# Altium schematic sheet 0083_USB3.SchDoc
size 848 x 558 mm
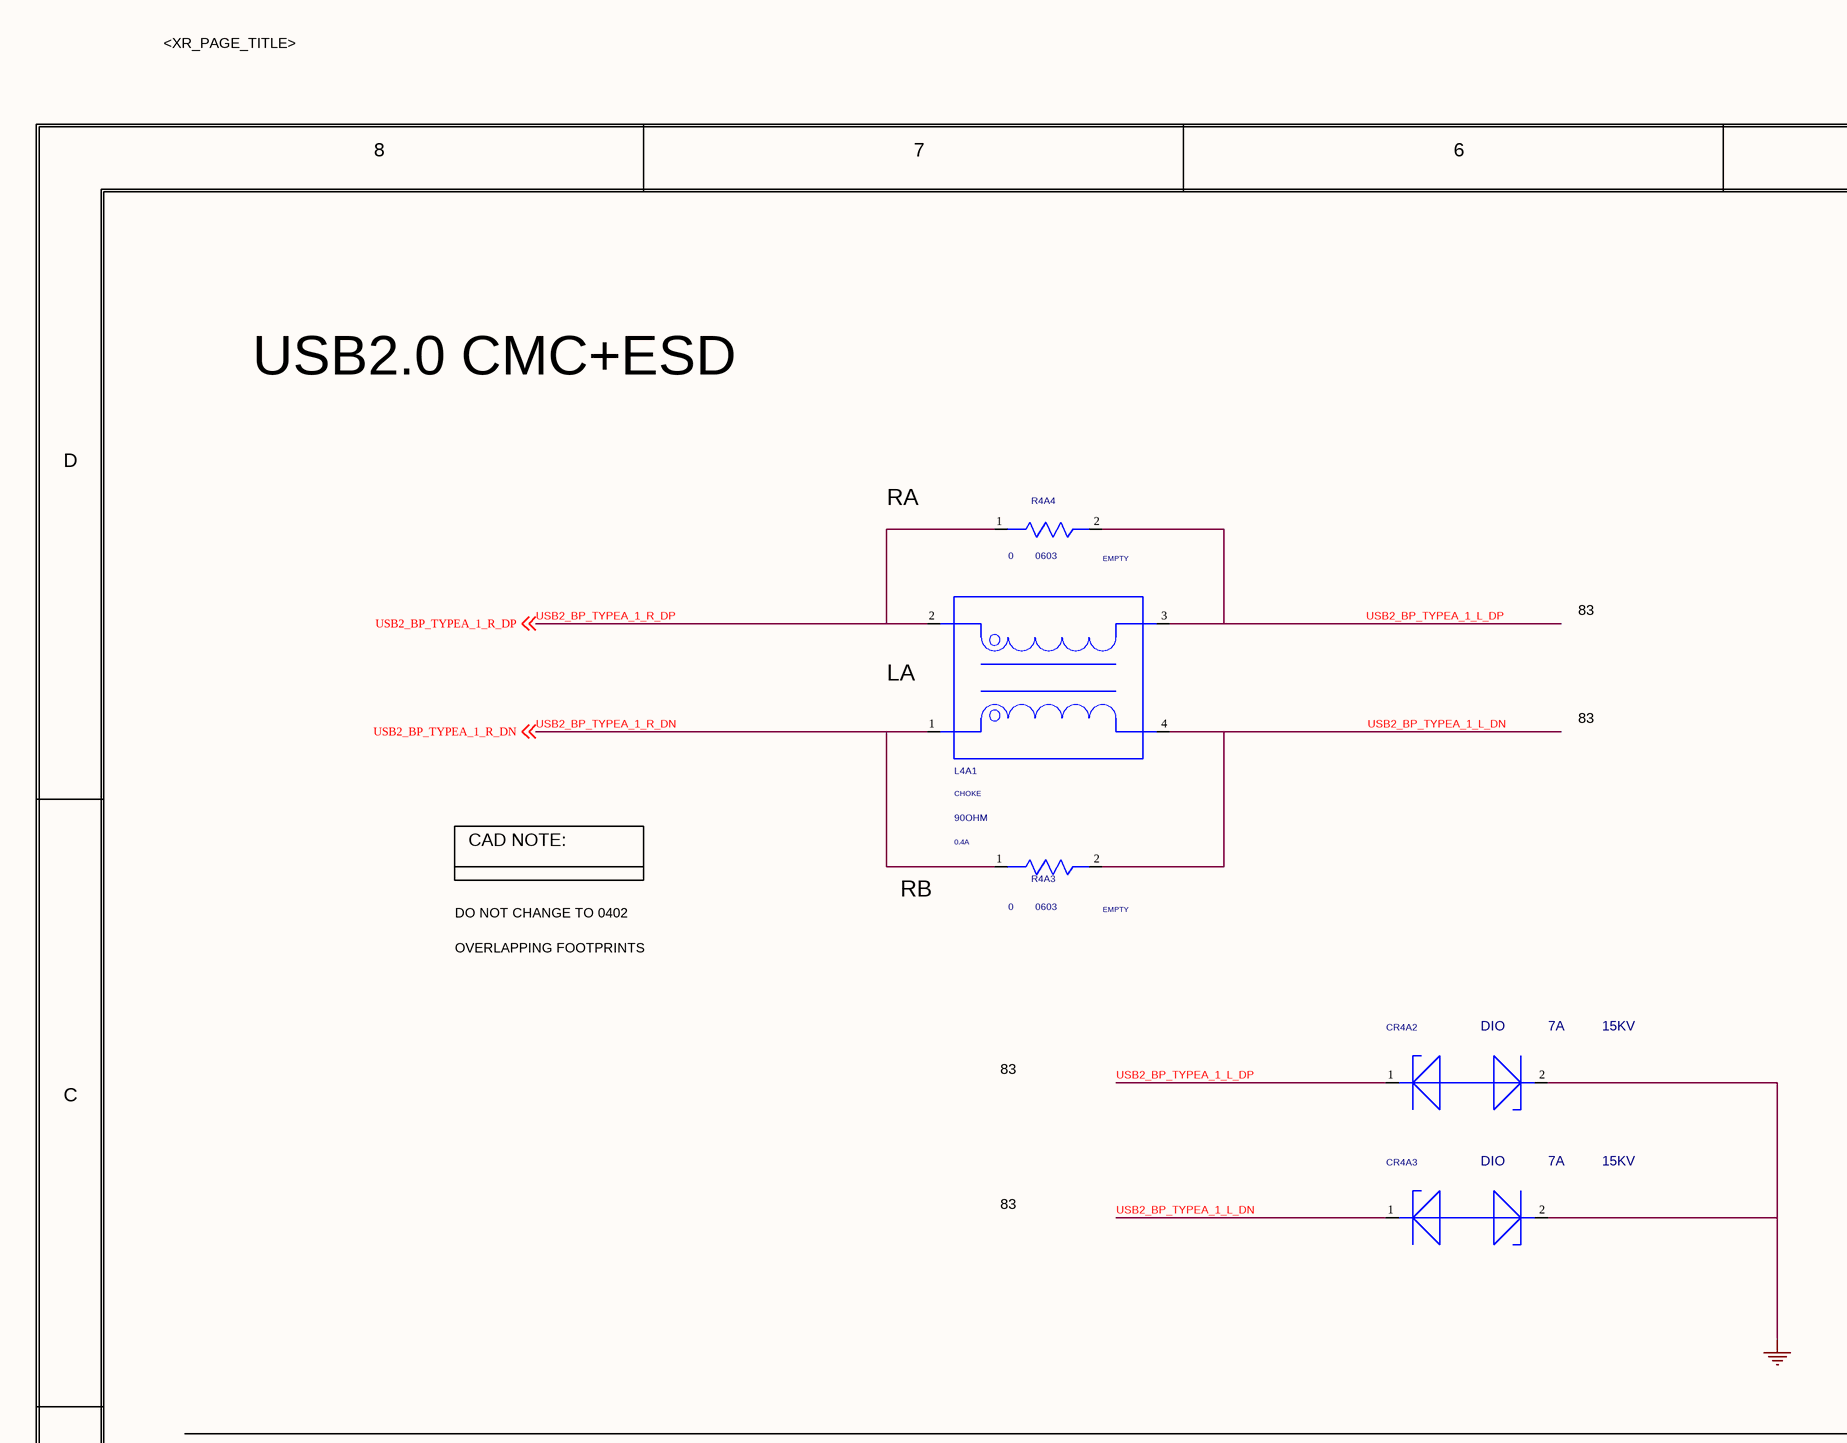
[diagram p0: 0083_USB3.SchDoc, top left]
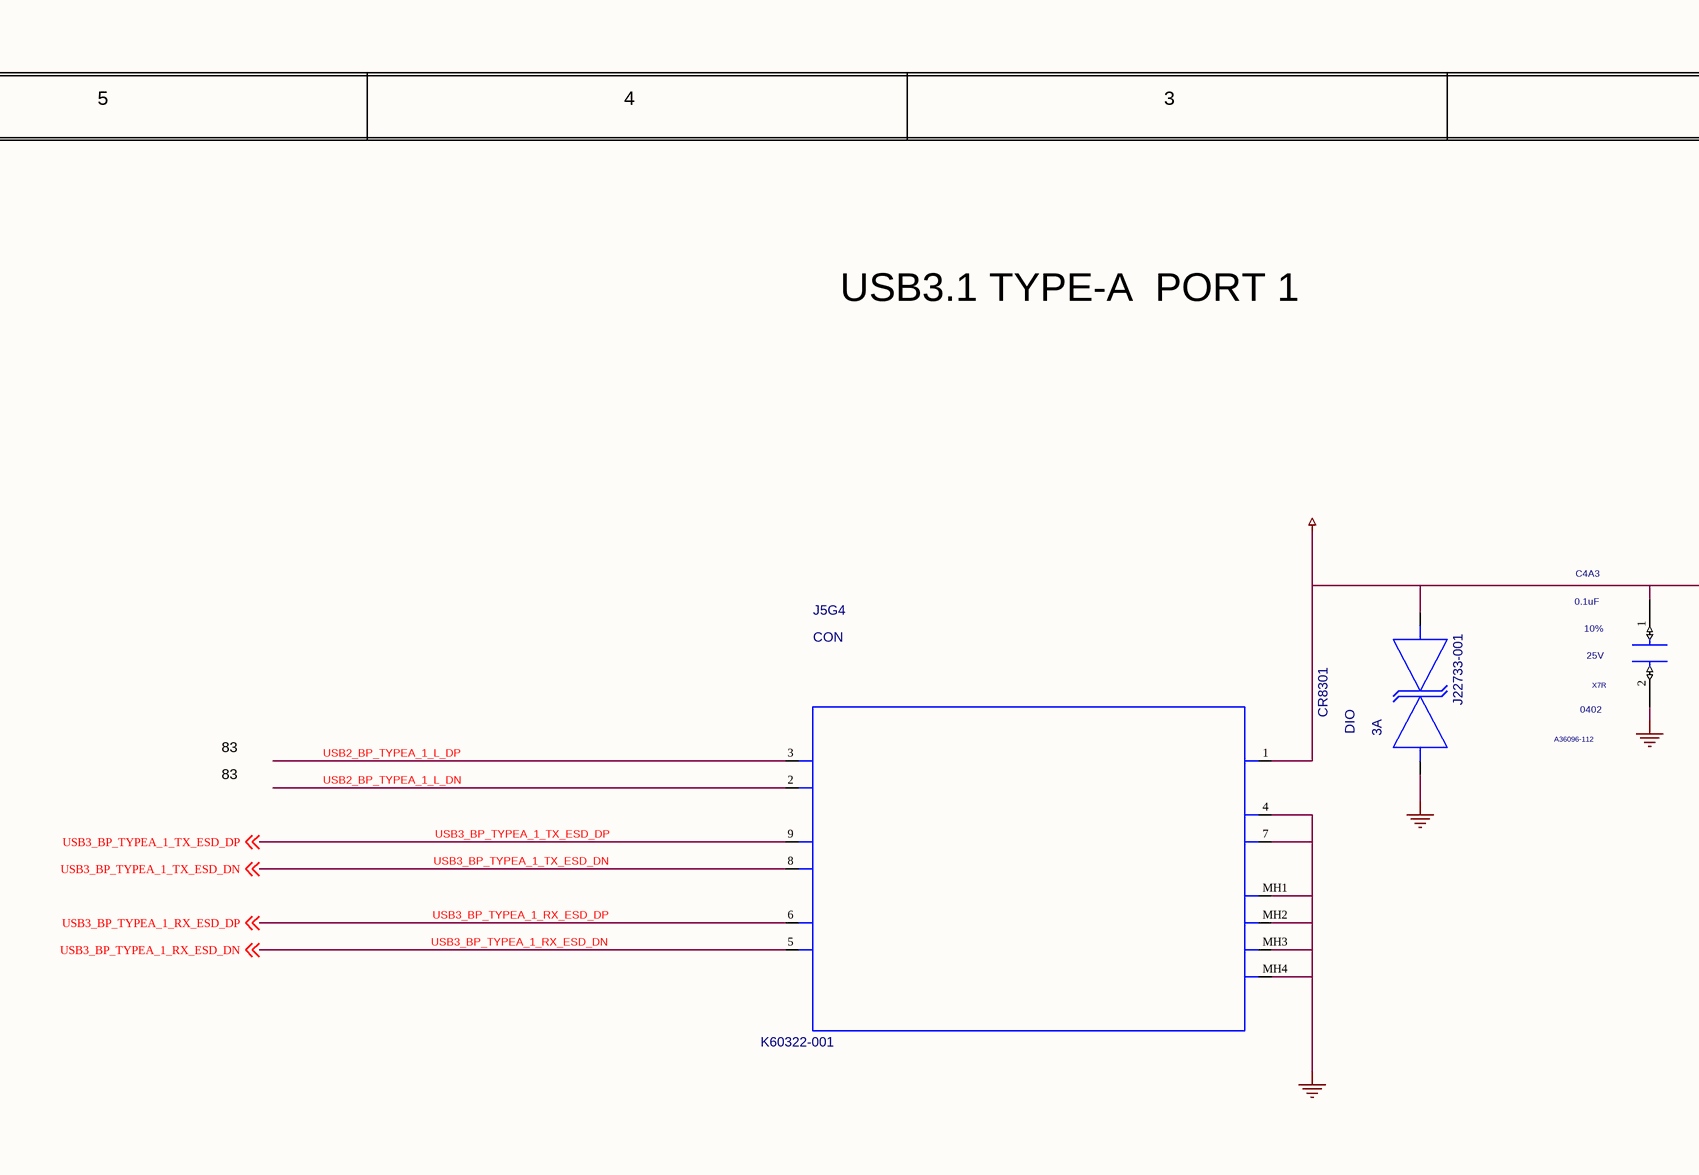
[diagram p1: 0083_USB3.SchDoc, top middle]
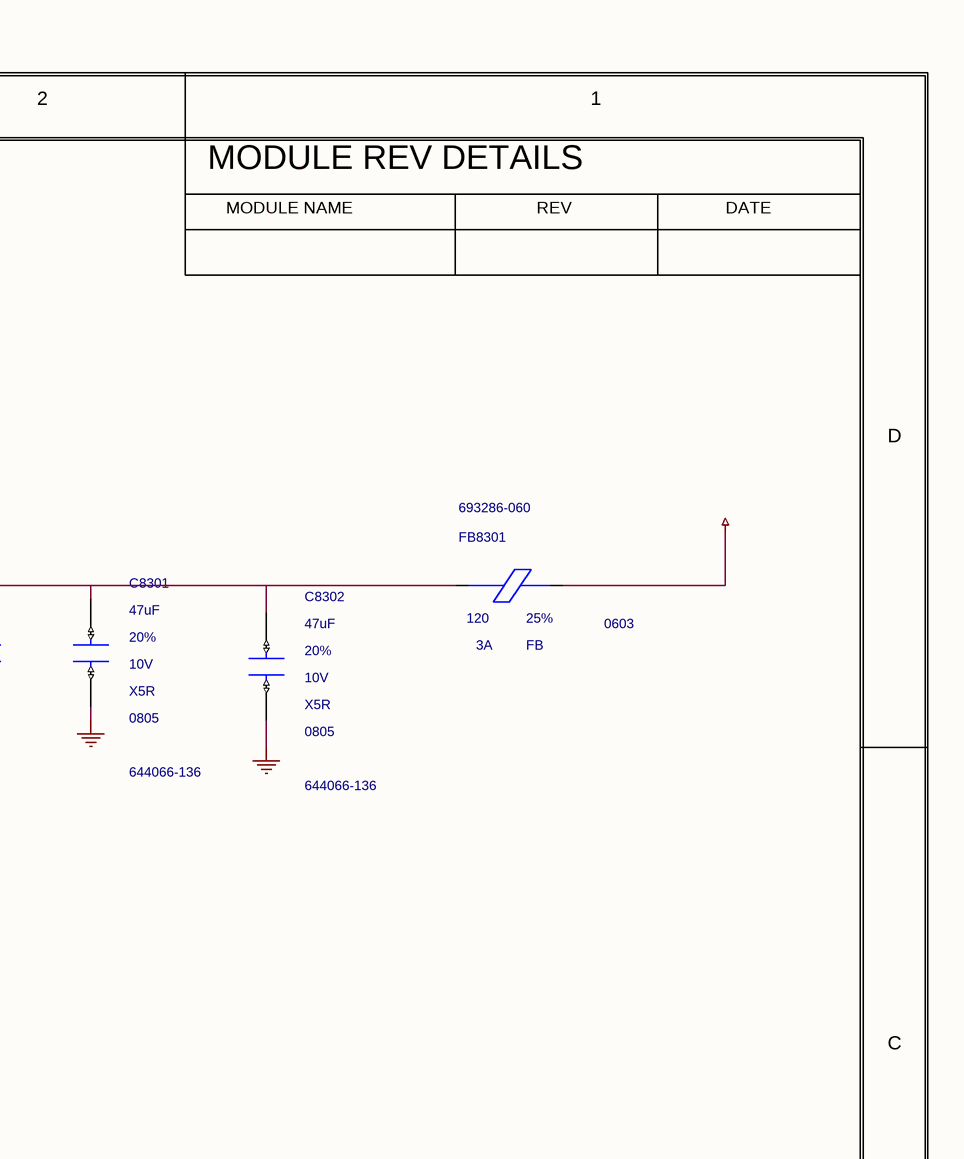
[diagram p2: 0083_USB3.SchDoc, top right]
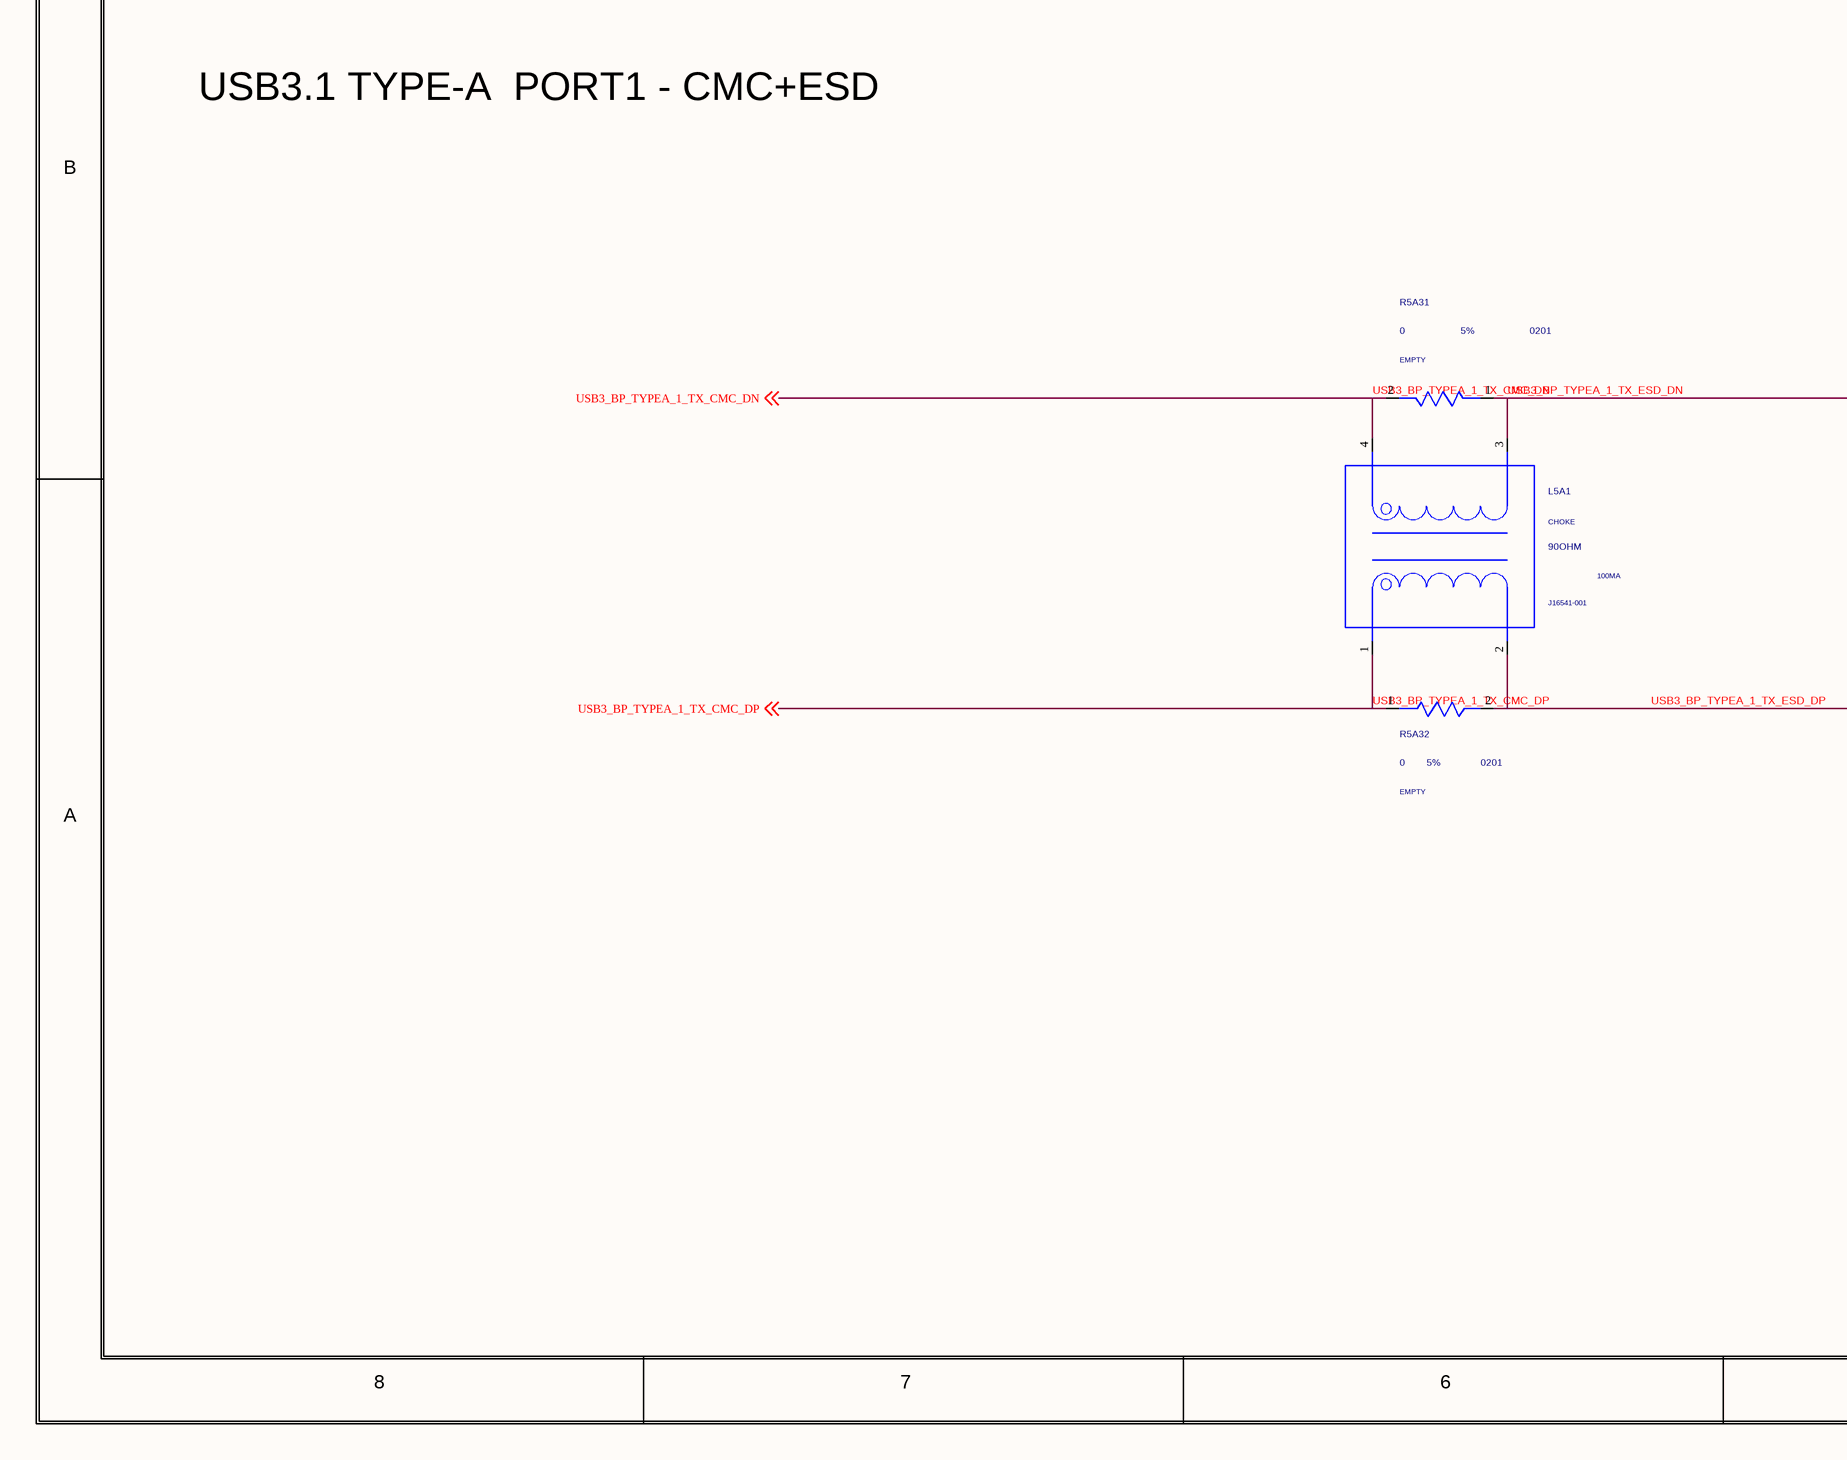
[diagram p3: 0083_USB3.SchDoc, bottom left]
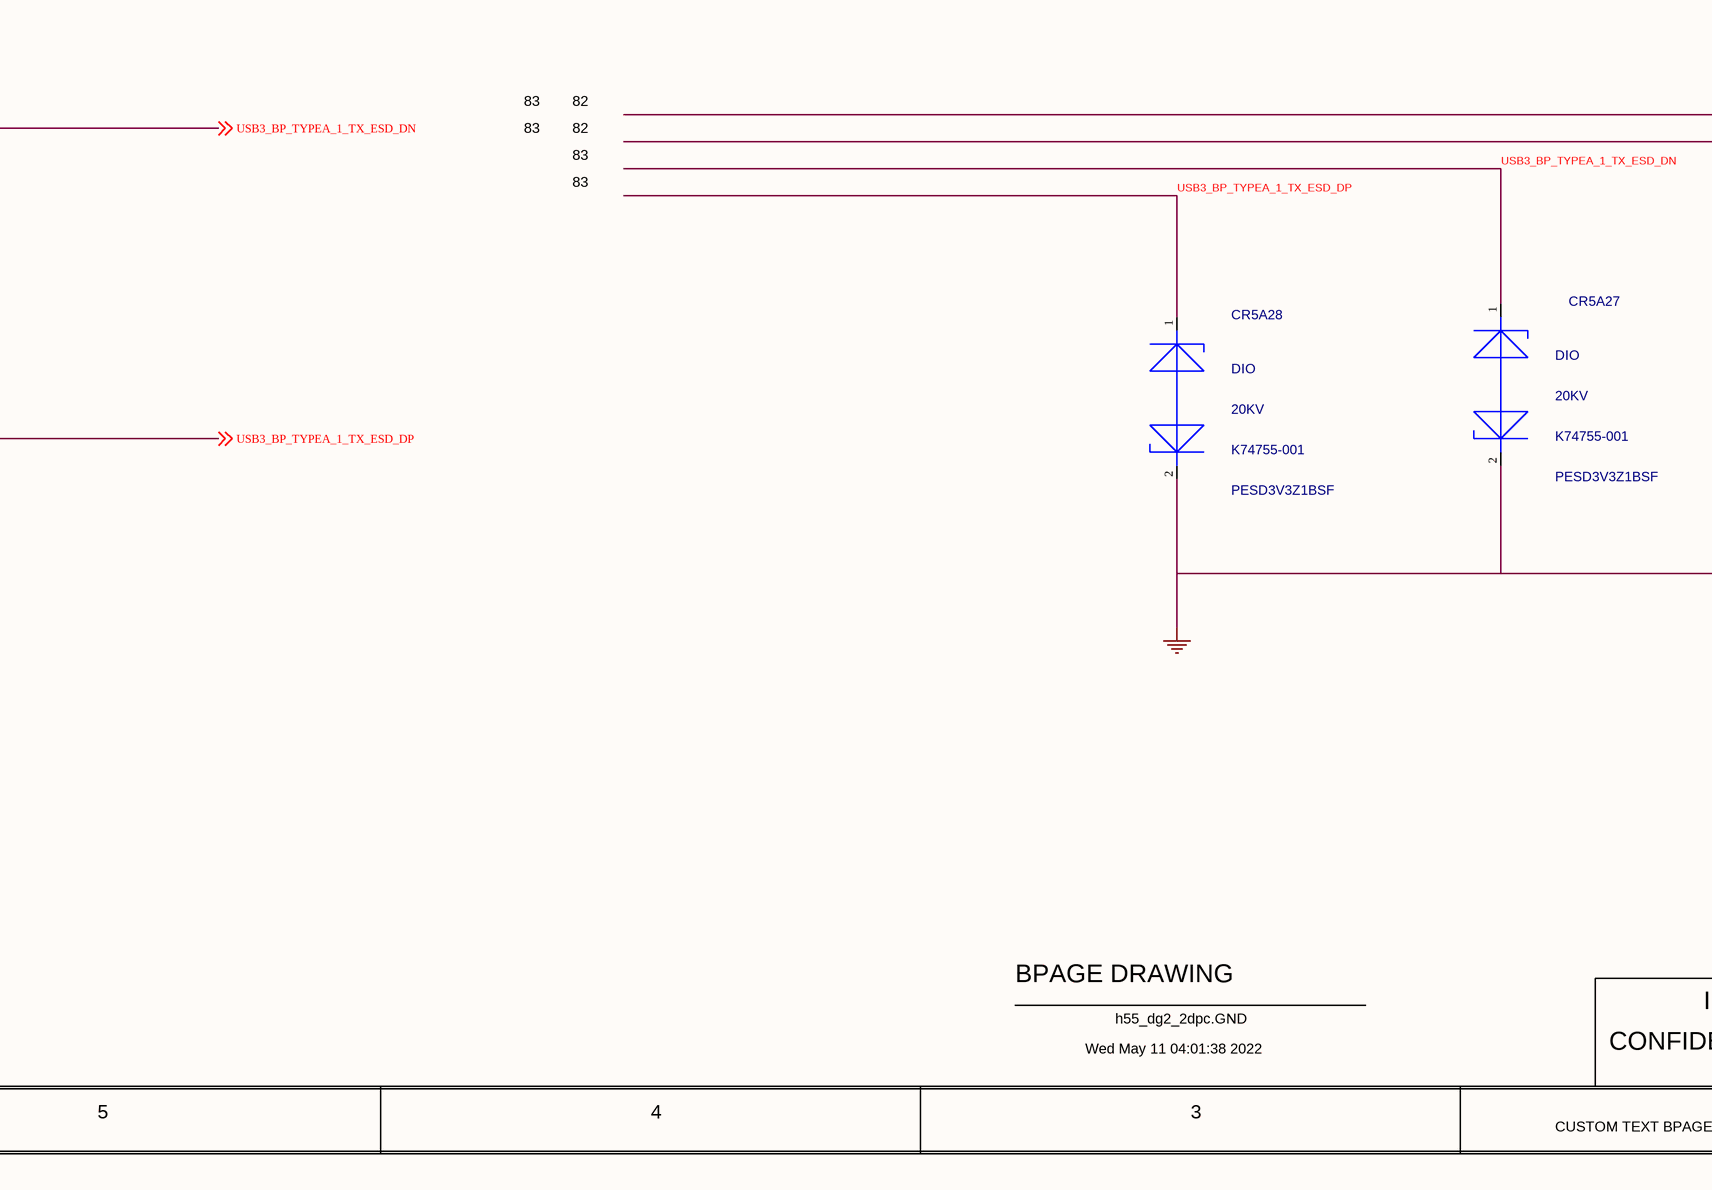
[diagram p4: 0083_USB3.SchDoc, bottom middle]
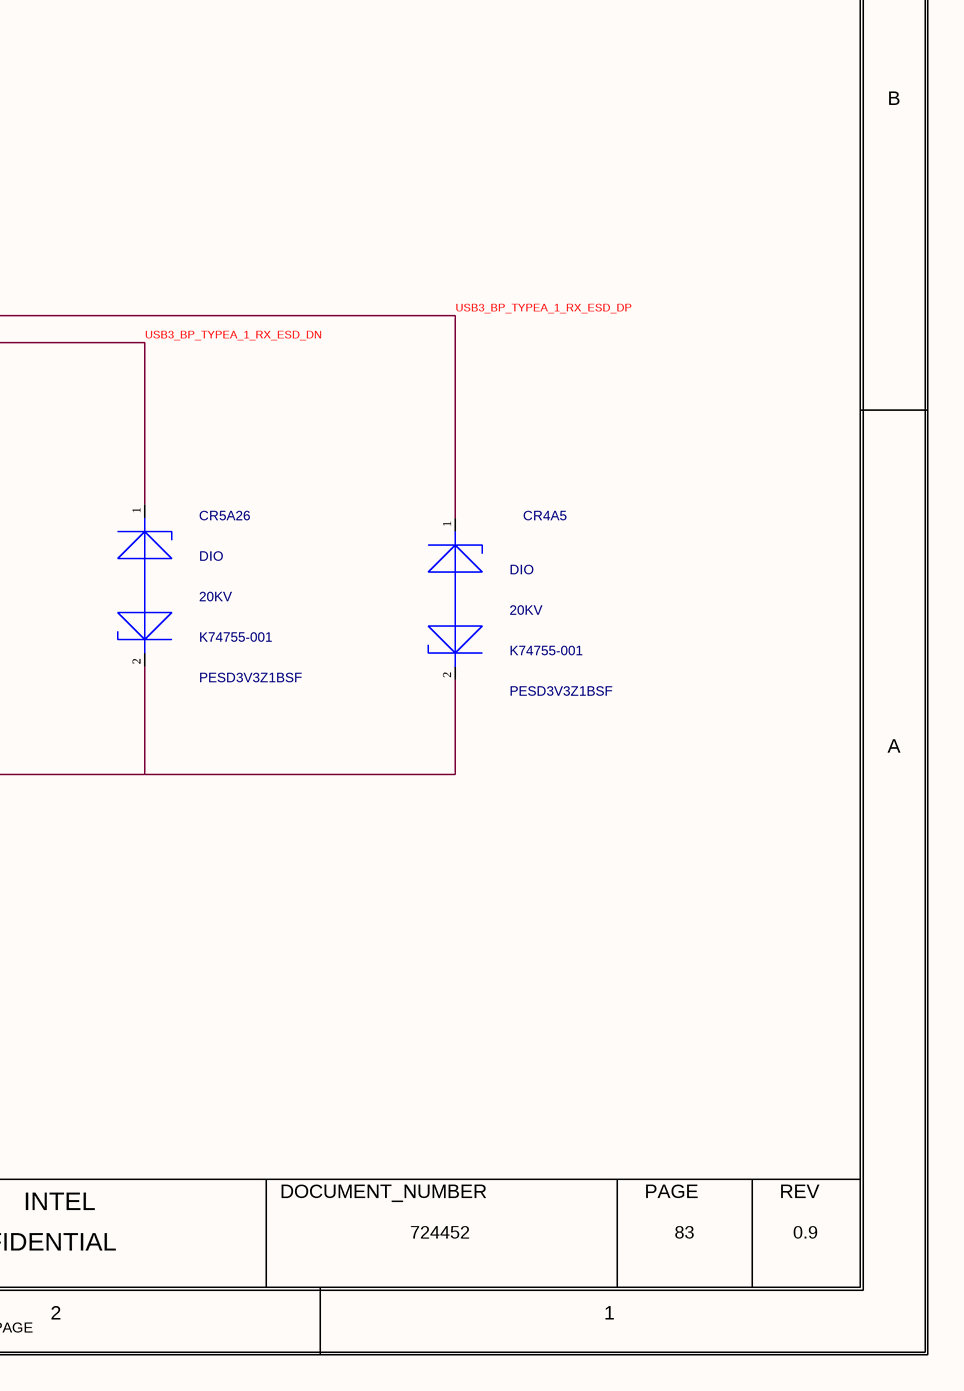
[diagram p5: 0083_USB3.SchDoc, bottom right]

## Parts
C4A3  0.1uF  MATERIAL: X7R  PACK_TYPE: 0402  PART_NUMBER: A36096-112  TOLERANCE: 10%  VOLTAGE: 25V  [SMC0402IA]
C8301  47uF  MATERIAL: X5R  PACK_TYPE: 0805  PART_NUMBER: 644066-136  TOLERANCE: 20%  VOLTAGE: 10V  [CTK2_SM0805_2200X1450_MA]
C8302  47uF  MATERIAL: X5R  PACK_TYPE: 0805  PART_NUMBER: 644066-136  TOLERANCE: 20%  VOLTAGE: 10V  [CTK2_SM0805_2200X1450_MA]
CR4A2  15KV  CURRENT: 7A  MATERIAL: DIO  [TK0_SOD962_600X300_MA]
CR4A3  15KV  CURRENT: 7A  MATERIAL: DIO  [TK0_SOD962_600X300_MA]
CR4A5  PESD3V3Z1BSF  CURRENT: 20KV  MATERIAL: DIO  PART_NUMBER: K74755-001  [TK0_SCR_625X325_MB]
CR5A26  PESD3V3Z1BSF  CURRENT: 20KV  MATERIAL: DIO  PART_NUMBER: K74755-001  [TK0_SCR_625X325_MB]
CR5A27  PESD3V3Z1BSF  CURRENT: 20KV  MATERIAL: DIO  PART_NUMBER: K74755-001  [TK0_SCR_625X325_MB]
CR5A28  PESD3V3Z1BSF  CURRENT: 20KV  MATERIAL: DIO  PART_NUMBER: K74755-001  [TK0_SCR_625X325_MB]
CR8301  CURRENT: 3A  MATERIAL: DIO  PART_NUMBER: J22733-001  [CTK2_SCR0201_610X310_MA]  (hidden comment: ESD200-B1-CSP0201)
FB8301  120  CURRENT: 3A  MATERIAL: FB  PACK_TYPE: 0603  PART_NUMBER: 693286-060  TOLERANCE: 25%  [CTK2_SM0603_1750X950_MA]
J5G4  MATERIAL: CON  PART_NUMBER: K60322-001  [CUSB3_MIDJR_9P_4EM_2000_MA_PIP_MR]  (hidden comment: C_USB3_TYPE_A_9P_4EM)
L4A1  90OHM  CURRENT: 0.4A  MATERIAL: CHOKE  [SMI4_79X47IA]
L5A1  90OHM  CURRENT: 100MA  MATERIAL: CHOKE  PART_NUMBER: J16541-001  [SMI4_50X65MA]
R4A3  0  MATERIAL: EMPTY  PACK_TYPE: 0603  [SMR0603IA]
R4A4  0  MATERIAL: EMPTY  PACK_TYPE: 0603  [SMR0603IA]
R5A31  0  MATERIAL: EMPTY  PACK_TYPE: 0201  TOLERANCE: 5%  [SMR0201IA]
R5A32  0  MATERIAL: EMPTY  PACK_TYPE: 0201  TOLERANCE: 5%  [SMR0201IA]

## Nets
+V5A_USB_P1: FB8301.2(B)
+V5A_USB_P1_FB: C4A3.1(A) C8301.1(A) C8302.1(A) CR8301.2(A2) FB8301.1(A) J5G4.1(VBUS_POWER)
GND: C4A3.2(B) C8301.2(B) C8302.2(B) CR4A2.2(K2) CR4A3.2(K2) CR4A5.2(K2) CR5A26.2(K2) CR5A27.2(K2) CR5A28.2(K2) CR8301.1(A1) J5G4.4(GND_POWER_RETURN) J5G4.7(GND) J5G4.MH1 J5G4.MH2 J5G4.MH3 J5G4.MH4
USB2_BP_TYPEA_1_L_DN: CR4A3.1(K1) J5G4.2(D_DN) L4A1.4(OUT_1) R4A3.2(B)
USB2_BP_TYPEA_1_L_DP: CR4A2.1(K1) J5G4.3(D_DP) L4A1.3(IN_2) R4A4.2(B)
USB2_BP_TYPEA_1_R_DN: L4A1.1(IN_1) R4A3.1(A) ; off-sheet USB2_BP_TYPEA_1_R_DN
USB2_BP_TYPEA_1_R_DP: L4A1.2(OUT_2) R4A4.1(A) ; off-sheet USB2_BP_TYPEA_1_R_DP
USB3_BP_TYPEA_1_RX_ESD_DN: CR5A26.1(K1) J5G4.5(SSRX_DN) ; off-sheet USB3_BP_TYPEA_1_RX_ESD_DN
USB3_BP_TYPEA_1_RX_ESD_DP: CR4A5.1(K1) J5G4.6(SSRX_DP) ; off-sheet USB3_BP_TYPEA_1_RX_ESD_DP
USB3_BP_TYPEA_1_TX_CMC_DN: L5A1.4(PIN4) R5A31.2(B) ; off-sheet USB3_BP_TYPEA_1_TX_CMC_DN
USB3_BP_TYPEA_1_TX_CMC_DP: L5A1.1(PIN1) R5A32.1(A) ; off-sheet USB3_BP_TYPEA_1_TX_CMC_DP
USB3_BP_TYPEA_1_TX_ESD_DN: CR5A27.1(K1) J5G4.8(SSTX_DN) L5A1.3(PIN3) R5A31.1(A) ; off-sheet USB3_BP_TYPEA_1_TX_ESD_DN
USB3_BP_TYPEA_1_TX_ESD_DP: CR5A28.1(K1) J5G4.9(SSTX_DP) L5A1.2(PIN2) R5A32.2(B) ; off-sheet USB3_BP_TYPEA_1_TX_ESD_DP

## Notes on the sheet
- <XR_PAGE_TITLE>
- 8
- 7
- 6
- 5
- 4
- 3
- 2
- 1
- MODULE REV DETAILS
- MODULE NAME
- REV
- DATE
- USB2.0 CMC+ESD
- USB3.1 TYPE-A  PORT 1
- D
- RA
- 83
- (near L4A1) LA
- CAD NOTE:
- DO NOT CHANGE TO 0402
- RB
- OVERLAPPING FOOTPRINTS
- C
- USB3.1 TYPE-A  PORT1 - CMC+ESD
- B
- 82
- A
- BPAGE DRAWING
- INTEL
- DOCUMENT_NUMBER
- PAGE
- Wed May 11 04:01:38 2022
- h55_dg2_2dpc.GND
- CONFIDENTIAL
- 724452
- 0.9
- CUSTOM TEXT BPAGE

## Library data of the parts
C4A3 = CAP: CDS_PHYS_PART_NAME: CAP_0402-A36096-112,X7R,0.1UF,25V,10%,LPDB,GENERIC; OriginalSymbolOrigin: (-50,25); XY: (-1625,4050); VER: 1; ROT: 2; PHYS_PAGE: 83; LOCATION: C4A3; IP: GENERIC; FP_TECH: LPDB; DRAWING: @RVP1_ADL_SB_ADP_S_DDR5_SODIMM_2DPC_LIB.H55_DG2_2DPC(SCH_1):PAGE455; CDS_LIB: discrete; PCB Footprint: SMC0402IA; CHIPS_PART_NAME: CAP; CDS_PART_NAME: CAP_0402-A36096-112,X7R,0.1UF,25V,10%,LPDB,GENERIC; CDS_LOCATION: C4A3; ASI_MODEL: A36096-112
C8301 = C_CAP: CDS_PHYS_PART_NAME: C_CAP_0805-644066-136,X5R,47UF,10V,20%,TK2,GENERIC; CDS_LMAN_SYM_OUTLINE: -50,50,50,-50; FP_TECH: TK2; IP: GENERIC; ROOM: NONE; OriginalSymbolOrigin: (-50,25); XY: (-1425,4050); VER: 1; ROT: 0; PHYS_PAGE: 83; LOCATION: C8301; DRAWING: @RVP1_ADL_SB_ADP_S_DDR5_SODIMM_2DPC_LIB.H55_DG2_2DPC(SCH_1):PAGE455; CDS_LIB: c_discrete; VARIANT: ?; PCB Footprint: CTK2_SM0805_2200X1450_MA; CHIPS_PART_NAME: C_CAP; CDS_PART_NAME: C_CAP_0805-644066-136,X5R,47UF,10V,20%,TK2,GENERIC; CDS_LOCATION: C8301
C8302 = C_CAP: CDS_PHYS_PART_NAME: C_CAP_0805-644066-136,X5R,47UF,10V,20%,TK2,GENERIC; CDS_LMAN_SYM_OUTLINE: -50,50,50,-50; FP_TECH: TK2; IP: GENERIC; ROOM: NONE; OriginalSymbolOrigin: (-50,25); XY: (-1100,4025); VER: 1; ROT: 0; PHYS_PAGE: 83; LOCATION: C8302; DRAWING: @RVP1_ADL_SB_ADP_S_DDR5_SODIMM_2DPC_LIB.H55_DG2_2DPC(SCH_1):PAGE455; CDS_LIB: c_discrete; VARIANT: ?; PCB Footprint: CTK2_SM0805_2200X1450_MA; CHIPS_PART_NAME: C_CAP; CDS_PART_NAME: C_CAP_0805-644066-136,X5R,47UF,10V,20%,TK2,GENERIC; CDS_LOCATION: C8302
CR4A2 = DIODE_ESD_BIDIR_2: PART_NUMBER: J24007-001; CDS_PHYS_PART_NAME: DIODE_ESD_BIDIR_2_SOD962-J24007-001,DIO,15KV,7A,TK0,GENERIC; BOM_USE: STUFF; CDS_LMAN_SYM_OUTLINE: -150,150,150,-150; FP_TECH: TK0; IP: GENERIC; PACK_TYPE: SOD962; ROOM: NONE; OriginalSymbolOrigin: (-125,50); XY: (-5475,3350); VER: 1; ROT: 0; PHYS_PAGE: 83; LOCATION: CR4A2; DRAWING: @RVP1_ADL_SB_ADP_S_DDR5_SODIMM_2DPC_LIB.H55_DG2_2DPC(SCH_1):PAGE455; CDS_LIB: discrete_2; VARIANT: ?; PCB Footprint: TK0_SOD962_600X300_MA; CHIPS_PART_NAME: DIODE_ESD_BIDIR_2; CDS_PART_NAME: DIODE_ESD_BIDIR_2_SOD962-J24007-001,DIO,15KV,7A,TK0,GENERIC; CDS_LOCATION: CR4A2; ASI_MODEL: J24007-001
CR4A3 = DIODE_ESD_BIDIR_2: PART_NUMBER: J24007-001; CDS_PHYS_PART_NAME: DIODE_ESD_BIDIR_2_SOD962-J24007-001,DIO,15KV,7A,TK0,GENERIC; BOM_USE: STUFF; CDS_LMAN_SYM_OUTLINE: -150,150,150,-150; FP_TECH: TK0; IP: GENERIC; PACK_TYPE: SOD962; ROOM: NONE; OriginalSymbolOrigin: (-125,50); XY: (-5475,3100); VER: 1; ROT: 0; PHYS_PAGE: 83; LOCATION: CR4A3; DRAWING: @RVP1_ADL_SB_ADP_S_DDR5_SODIMM_2DPC_LIB.H55_DG2_2DPC(SCH_1):PAGE455; CDS_LIB: discrete_2; VARIANT: ?; PCB Footprint: TK0_SOD962_600X300_MA; CHIPS_PART_NAME: DIODE_ESD_BIDIR_2; CDS_PART_NAME: DIODE_ESD_BIDIR_2_SOD962-J24007-001,DIO,15KV,7A,TK0,GENERIC; CDS_LOCATION: CR4A3; ASI_MODEL: J24007-001
CR4A5 = DIODE_ESD_BIDIR_2: CDS_PHYS_PART_NAME: DIODE_ESD_BIDIR_2_SOD962-K74755-001,DIO,PESD3V3Z1BSF,20KV,TK0,GA; BOM_USE: STUFF; CDS_LMAN_SYM_OUTLINE: -150,150,150,-150; FP_TECH: TK0; IP: GENERIC; PACK_TYPE: SOD962; ROOM: NONE; OriginalSymbolOrigin: (-125,50); XY: (-750,1275); VER: 1; ROT: 5; PHYS_PAGE: 83; LOCATION: CR4A5; DRAWING: @RVP1_ADL_SB_ADP_S_DDR5_SODIMM_2DPC_LIB.H55_DG2_2DPC(SCH_1):PAGE455; CDS_LIB: discrete_2; VARIANT: ?; PCB Footprint: TK0_SCR_625X325_MB; CHIPS_PART_NAME: DIODE_ESD_BIDIR_2; CDS_PART_NAME: DIODE_ESD_BIDIR_2_SOD962-K74755-001,DIO,PESD3V3Z1BSF,20KV,TK0,GA; CDS_LOCATION: CR4A5
CR5A26 = DIODE_ESD_BIDIR_2: CDS_PHYS_PART_NAME: DIODE_ESD_BIDIR_2_SOD962-K74755-001,DIO,PESD3V3Z1BSF,20KV,TK0,GA; BOM_USE: STUFF; CDS_LMAN_SYM_OUTLINE: -150,150,150,-150; FP_TECH: TK0; IP: GENERIC; PACK_TYPE: SOD962; ROOM: NONE; OriginalSymbolOrigin: (-125,50); XY: (-1325,1300); VER: 1; ROT: 5; PHYS_PAGE: 83; LOCATION: CR5A26; DRAWING: @RVP1_ADL_SB_ADP_S_DDR5_SODIMM_2DPC_LIB.H55_DG2_2DPC(SCH_1):PAGE455; CDS_LIB: discrete_2; VARIANT: ?; PCB Footprint: TK0_SCR_625X325_MB; CHIPS_PART_NAME: DIODE_ESD_BIDIR_2; CDS_PART_NAME: DIODE_ESD_BIDIR_2_SOD962-K74755-001,DIO,PESD3V3Z1BSF,20KV,TK0,GA; CDS_LOCATION: CR5A26
CR5A27 = DIODE_ESD_BIDIR_2: CDS_PHYS_PART_NAME: DIODE_ESD_BIDIR_2_SOD962-K74755-001,DIO,PESD3V3Z1BSF,20KV,TK0,GA; BOM_USE: STUFF; CDS_LMAN_SYM_OUTLINE: -150,150,150,-150; FP_TECH: TK0; IP: GENERIC; PACK_TYPE: SOD962; ROOM: NONE; OriginalSymbolOrigin: (-125,50); XY: (-1925,1300); VER: 1; ROT: 5; PHYS_PAGE: 83; LOCATION: CR5A27; DRAWING: @RVP1_ADL_SB_ADP_S_DDR5_SODIMM_2DPC_LIB.H55_DG2_2DPC(SCH_1):PAGE455; CDS_LIB: discrete_2; VARIANT: ?; PCB Footprint: TK0_SCR_625X325_MB; CHIPS_PART_NAME: DIODE_ESD_BIDIR_2; CDS_PART_NAME: DIODE_ESD_BIDIR_2_SOD962-K74755-001,DIO,PESD3V3Z1BSF,20KV,TK0,GA; CDS_LOCATION: CR5A27
CR5A28 = DIODE_ESD_BIDIR_2: CDS_PHYS_PART_NAME: DIODE_ESD_BIDIR_2_SOD962-K74755-001,DIO,PESD3V3Z1BSF,20KV,TK0,GA; BOM_USE: STUFF; CDS_LMAN_SYM_OUTLINE: -150,150,150,-150; FP_TECH: TK0; IP: GENERIC; PACK_TYPE: SOD962; ROOM: NONE; OriginalSymbolOrigin: (-125,50); XY: (-2525,1275); VER: 1; ROT: 5; PHYS_PAGE: 83; LOCATION: CR5A28; DRAWING: @RVP1_ADL_SB_ADP_S_DDR5_SODIMM_2DPC_LIB.H55_DG2_2DPC(SCH_1):PAGE455; CDS_LIB: discrete_2; VARIANT: ?; PCB Footprint: TK0_SCR_625X325_MB; CHIPS_PART_NAME: DIODE_ESD_BIDIR_2; CDS_PART_NAME: DIODE_ESD_BIDIR_2_SOD962-K74755-001,DIO,PESD3V3Z1BSF,20KV,TK0,GA; CDS_LOCATION: CR5A28
CR8301 = C_DIODE_TVS: CDS_PHYS_PART_NAME: C_DIODE_TVS_SM-J22733-001,DIO,ESD200-B1-CSP0201,3A,TK2,GENERIC; CDS_LMAN_SYM_OUTLINE: -100,50,100,-50; FP_TECH: TK2; IP: GENERIC; PACK_TYPE: SM; ROOM: NONE; OriginalSymbolOrigin: (-125,50); XY: (-2050,3975); VER: 1; PHYS_PAGE: 83; LOCATION: CR8301; DRAWING: @RVP1_ADL_SB_ADP_S_DDR5_SODIMM_2DPC_LIB.H55_DG2_2DPC(SCH_1):PAGE455; CDS_LIB: local; VARIANT: ?; PCB Footprint: CTK2_SCR0201_610X310_MA; ROT: 1; CHIPS_PART_NAME: C_DIODE_TVS; CDS_PART_NAME: C_DIODE_TVS_SM-J22733-001,DIO,ESD200-B1-CSP0201,3A,TK2,GENERIC; CDS_LOCATION: CR8301
FB8301 = C_FERRITE: CDS_PHYS_PART_NAME: C_FERRITE_0603-693286-060,FB,120,25%,3A,TK2,GENERIC; CDS_LMAN_SYM_OUTLINE: -50,50,50,-50; FP_TECH: TK2; IP: GENERIC; ROOM: NONE; OriginalSymbolOrigin: (-75,50); XY: (-650,4175); VER: 1; ROT: 0; PHYS_PAGE: 83; LOCATION: FB8301; DRAWING: @RVP1_ADL_SB_ADP_S_DDR5_SODIMM_2DPC_LIB.H55_DG2_2DPC(SCH_1):PAGE455; CDS_LIB: c_discrete; VARIANT: ?; PCB Footprint: CTK2_SM0603_1750X950_MA; CHIPS_PART_NAME: C_FERRITE; CDS_PART_NAME: C_FERRITE_0603-693286-060,FB,120,25%,3A,TK2,GENERIC; CDS_LOCATION: FB8301
J5G4 = C_USB3_TYPE_A_9P_4EM: CDS_PHYS_PART_NAME: C_USB3_TYPE_A_9P_4EM_TH-K60322-001,CON,USB3P1_GEN2_9P_4EM,TK0,GA; CDS_LMAN_SYM_OUTLINE: -400,300,400,-300; FP_TECH: TK0; IP: GENERIC; PACK_TYPE: TH; ROOM: NONE; OriginalSymbolOrigin: (-425,300); XY: (-2775,3650); VER: 1; ROT: 0; PHYS_PAGE: 83; LOCATION: J5G4; DRAWING: @RVP1_ADL_SB_ADP_S_DDR5_SODIMM_2DPC_LIB.H55_DG2_2DPC(SCH_1):PAGE455; CDS_LIB: local; VARIANT: ?; PCB Footprint: CUSB3_MIDJR_9P_4EM_2000_MA_PIP_MR; SEC_TYPE: TH; CHIPS_PART_NAME: C_USB3_TYPE_A_9P_4EM; CDS_PART_NAME: C_USB3_TYPE_A_9P_4EM_TH-K60322-001,CON,USB3P1_GEN2_9P_4EM,TK0,GA; CDS_LOCATION: J5G4
L4A1 = IND_4PIN: PART_NUMBER: 752402-015; CDS_PHYS_PART_NAME: IND_4PIN_0805-752402-015,CHOKE,90OHM,NA,0.4A,LPDB,GENERIC; CDS_LMAN_SYM_OUTLINE: -200,150,150,-150; PACK_TYPE: 0805; TOLERANCE: NA; OriginalSymbolOrigin: (-225,150); XY: (-6225,4100); VER: 2; ROT: 6; PHYS_PAGE: 83; LOCATION: L4A1; IP: GENERIC; FP_TECH: LPDB; FIN: USB_BPR; DRAWING: @RVP1_ADL_SB_ADP_S_DDR5_SODIMM_2DPC_LIB.H55_DG2_2DPC(SCH_1):PAGE455; CDS_LIB: discrete; BOM: BP_USB_DUAL; PCB Footprint: SMI4_79X47IA; SEC_TYPE: 0805; CHIPS_PART_NAME: IND_4PIN; CDS_PART_NAME: IND_4PIN_0805-752402-015,CHOKE,90OHM,NA,0.4A,LPDB,GENERIC; CDS_LOCATION: L4A1; ASI_MODEL: 752402-015
L5A1 = CHOKE_4P: CDS_PHYS_PART_NAME: CHOKE_4P_SM3-J16541-001,CHOKE,90OHM,NA,100MA,LPDB,GENERIC; CDS_LMAN_SYM_OUTLINE: -150,200,150,-150; PACK_TYPE: SM3; TOLERANCE: NA; OriginalSymbolOrigin: (-175,200); XY: (-5550,1500); VER: 10; ROT: 7; PHYS_PAGE: 83; LOCATION: L5A1; IP: GENERIC; FP_TECH: LPDB; DRAWING: @RVP1_ADL_SB_ADP_S_DDR5_SODIMM_2DPC_LIB.H55_DG2_2DPC(SCH_1):PAGE455; CDS_LIB: discrete; PCB Footprint: SMI4_50X65MA; SEC_TYPE: SM3; CHIPS_PART_NAME: CHOKE_4P; CDS_PART_NAME: CHOKE_4P_SM3-J16541-001,CHOKE,90OHM,NA,100MA,LPDB,GENERIC; CDS_LOCATION: L5A1; ASI_MODEL: J16541-001
R4A3 = RES#1: PART_NUMBER: A93552-004; CHIPS_PART_NAME: RES; CDS_PHYS_PART_NAME: RES_0603-A93552-004,EMPTY,0,5%,1/10W,LPDB,GENERIC; TOLERANCE: 5%; WATTAGE: 1/10W; OriginalSymbolOrigin: (-75,25); XY: (-6250,3750); VER: 1; PHYS_PAGE: 83; LOCATION: R4A3; IP: GENERIC; FP_TECH: LPDB; FIN: USB_BPR; DRAWING: @RVP1_ADL_SB_ADP_S_DDR5_SODIMM_2DPC_LIB.H55_DG2_2DPC(SCH_1):PAGE455; CDS_LIB: discrete; BOM: BP_USB_DUAL; PCB Footprint: SMR0603IA; ROT: 0; CDS_PART_NAME: RES_0603-A93552-004,EMPTY,0,5%,1/10W,LPDB,GENERIC; CDS_LOCATION: R4A3; ASI_MODEL: A93552-004
R4A4 = RES#1: PART_NUMBER: A93552-004; CHIPS_PART_NAME: RES; CDS_PHYS_PART_NAME: RES_0603-A93552-004,EMPTY,0,5%,1/10W,LPDB,GENERIC; TOLERANCE: 5%; WATTAGE: 1/10W; OriginalSymbolOrigin: (-75,25); XY: (-6250,4375); VER: 1; PHYS_PAGE: 83; LOCATION: R4A4; IP: GENERIC; FP_TECH: LPDB; FIN: USB_BPR; DRAWING: @RVP1_ADL_SB_ADP_S_DDR5_SODIMM_2DPC_LIB.H55_DG2_2DPC(SCH_1):PAGE455; CDS_LIB: discrete; BOM: BP_USB_DUAL; PCB Footprint: SMR0603IA; ROT: 0; CDS_PART_NAME: RES_0603-A93552-004,EMPTY,0,5%,1/10W,LPDB,GENERIC; CDS_LOCATION: R4A4; ASI_MODEL: A93552-004
R5A31 = RES#1: PART_NUMBER: C80792-009; CHIPS_PART_NAME: RES; CDS_PHYS_PART_NAME: RES_0201-C80792-009,EMPTY,0,5%,1/20W,LPDB,GENERIC; WATTAGE: 1/20W; OriginalSymbolOrigin: (-75,25); XY: (-5525,1775); VER: 1; ROT: 2; PHYS_PAGE: 83; LOCATION: R5A31; IP: GENERIC; FP_TECH: LPDB; FIN: USB_BPR; DRAWING: @RVP1_ADL_SB_ADP_S_DDR5_SODIMM_2DPC_LIB.H55_DG2_2DPC(SCH_1):PAGE455; CDS_LIB: discrete; PCB Footprint: SMR0201IA; CDS_PART_NAME: RES_0201-C80792-009,EMPTY,0,5%,1/20W,LPDB,GENERIC; CDS_LOCATION: R5A31; ASI_MODEL: C80792-009
R5A32 = RES#1: PART_NUMBER: C80792-009; CHIPS_PART_NAME: RES; CDS_PHYS_PART_NAME: RES_0201-C80792-009,EMPTY,0,5%,1/20W,LPDB,GENERIC; WATTAGE: 1/20W; OriginalSymbolOrigin: (-75,25); XY: (-5525,1200); VER: 1; PHYS_PAGE: 83; LOCATION: R5A32; IP: GENERIC; FP_TECH: LPDB; FIN: USB_BPR; DRAWING: @RVP1_ADL_SB_ADP_S_DDR5_SODIMM_2DPC_LIB.H55_DG2_2DPC(SCH_1):PAGE455; CDS_LIB: discrete; PCB Footprint: SMR0201IA; ROT: 0; CDS_PART_NAME: RES_0201-C80792-009,EMPTY,0,5%,1/20W,LPDB,GENERIC; CDS_LOCATION: R5A32; ASI_MODEL: C80792-009